# EAGLE design TuringGatesBuffer (EAGLE 9.6.2)
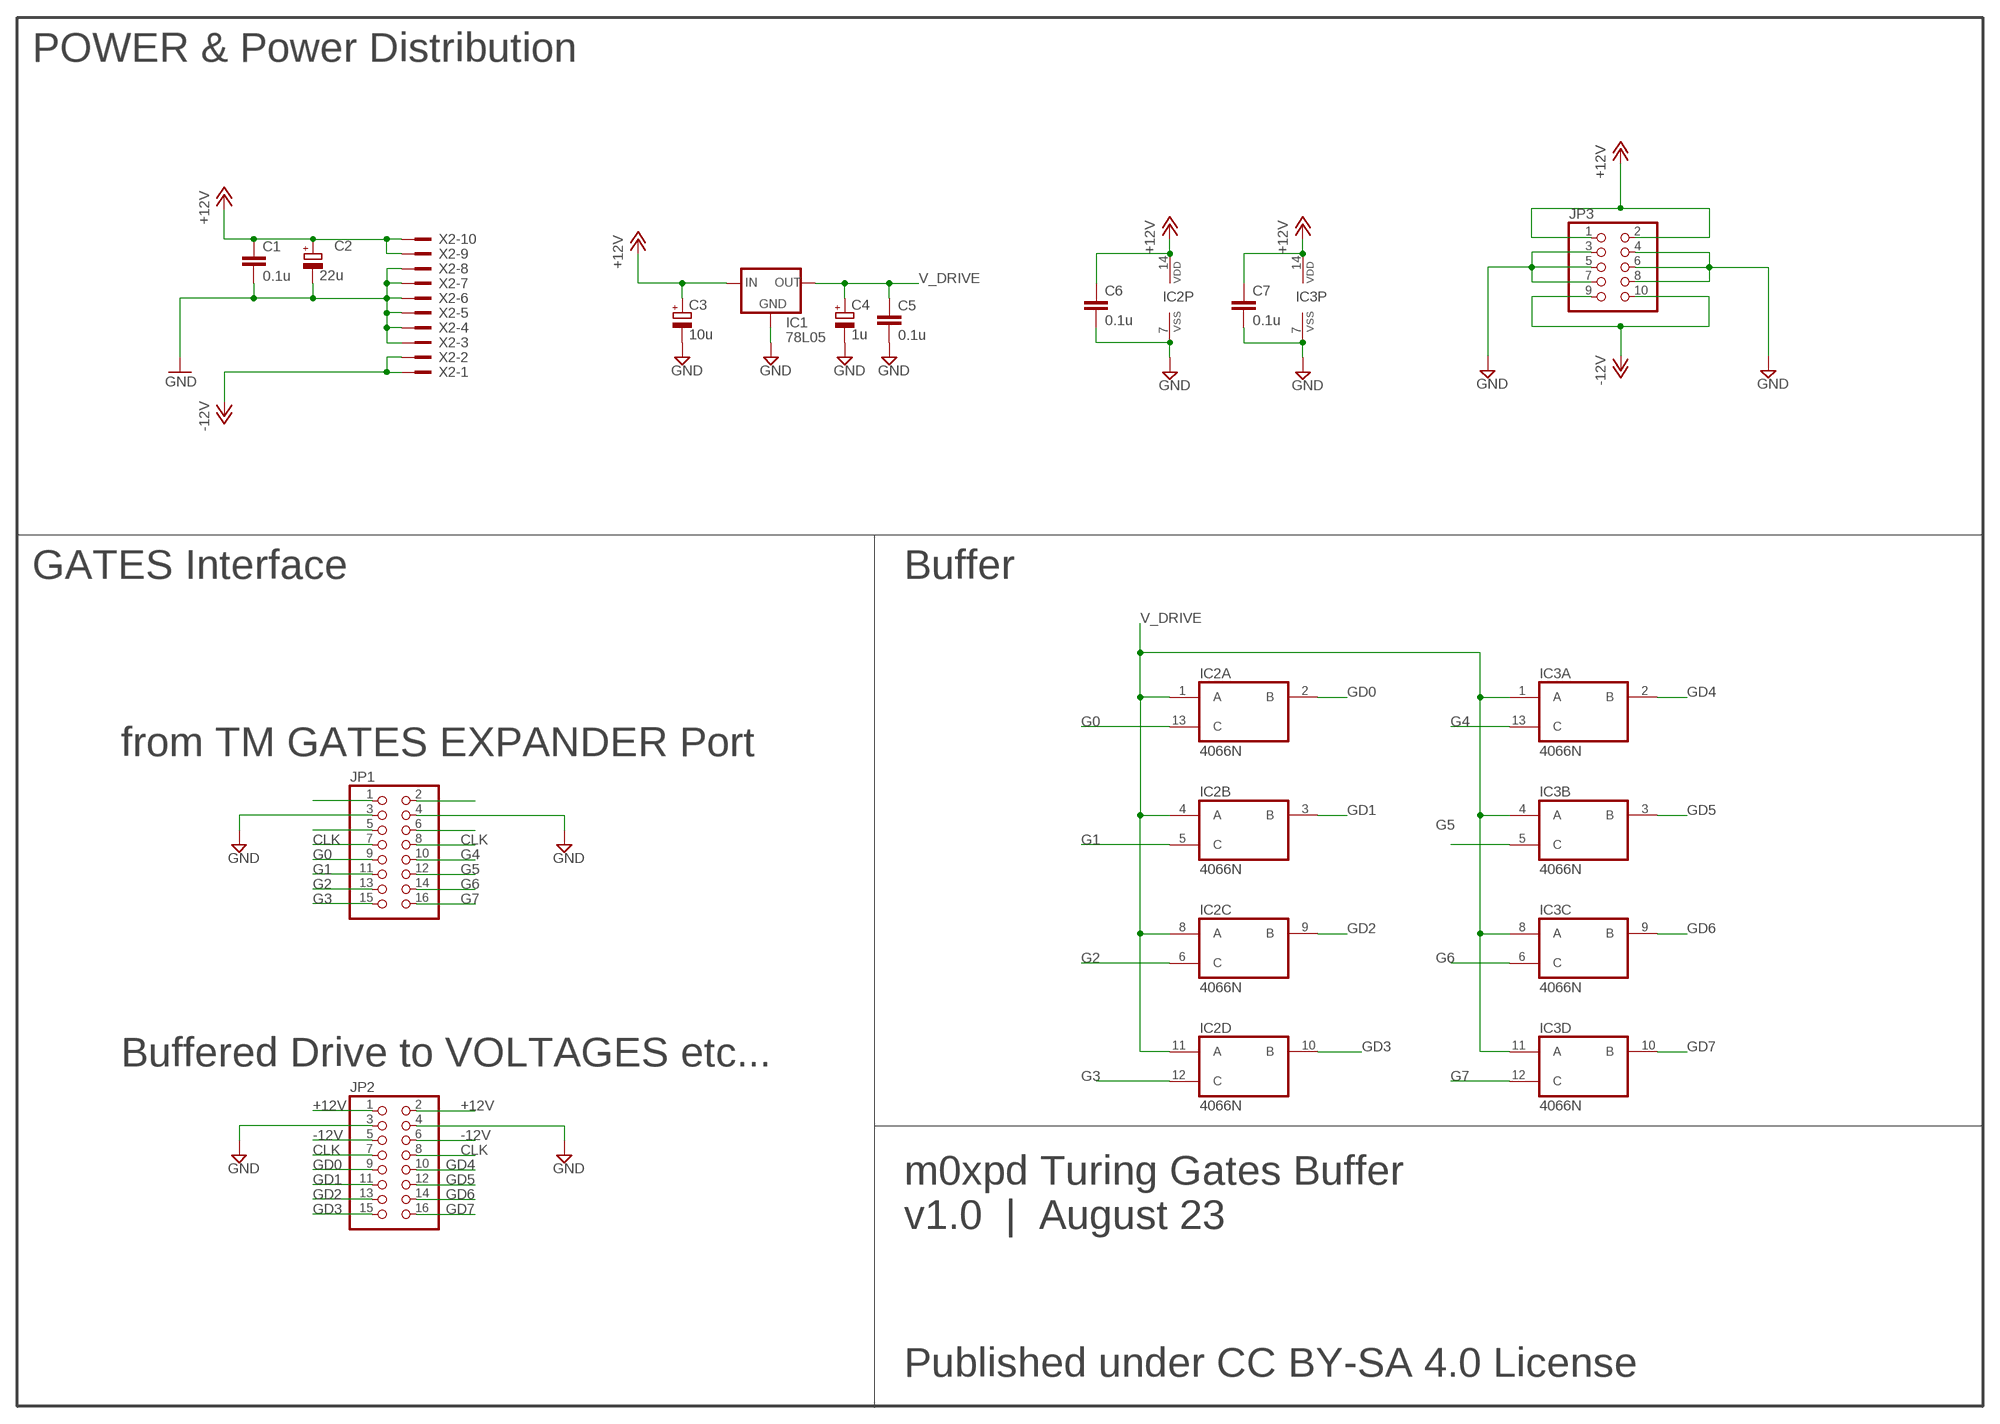
[diagram p0: schematic, sheet 1]

## Parts
C1  0.1u  C-EU050-025X075  [C050-025X075]
C2  22u  CPOL-EUE2.5-5  [E2,5-5]
C3  10u  CPOL-EUE2.5-5  [E2,5-5]
C4  1u  CPOL-EUE2.5-5  [E2,5-5]
C5  0.1u  C-EU050-025X075  [C050-025X075]
C6  0.1u  C-EU050-025X075  [C050-025X075]
C7  0.1u  C-EU050-025X075  [C050-025X075]
IC1  78L05  78LXX  [78LXX]
IC2  4066N  [DIL14]
IC3  4066N  [DIL14]
JP1  PINHD-2X8  [2X08]
JP2  PINHD-2X8  [2X08]
JP3  PINHD-2X5  [2X05]
X2  2510-  [PAK100/2500-10]

## Nets
+12V: C1.1 C2.+ C3.+ C6.1 C7.1 IC1.IN IC2.14(P:VDD) IC3.14(P:VDD) JP2.1 JP2.2 JP3.1 JP3.2 X2.9 X2.10
-12V: JP2.5 JP2.6 JP3.9 JP3.10 X2.1 X2.2
CLK: JP1.7 JP1.8 JP2.7 JP2.8
G0: IC2.13(A:C) JP1.9
G1: IC2.5(B:C) JP1.11
G2: IC2.6(C:C) JP1.13
G3: IC2.12(D:C) JP1.15
G4: IC3.13(A:C) JP1.10
G5: IC3.5(B:C) JP1.12
G6: IC3.6(C:C) JP1.14
G7: IC3.12(D:C) JP1.16
GD0: IC2.2(A:B) JP2.9
GD1: IC2.3(B:B) JP2.11
GD2: IC2.9(C:B) JP2.13
GD3: IC2.10(D:B) JP2.15
GD4: IC3.2(A:B) JP2.10
GD5: IC3.3(B:B) JP2.12
GD6: IC3.9(C:B) JP2.14
GD7: IC3.10(D:B) JP2.16
GND: C1.2 C2.- C3.- C4.- C5.2 C6.2 C7.2 IC1.GND IC2.7(P:VSS) IC3.7(P:VSS) JP1.3 JP1.4 JP2.3 JP2.4 JP3.3 JP3.4 JP3.5 JP3.6 JP3.7 JP3.8 X2.3 X2.4 X2.5 X2.6 X2.7 X2.8
N$1: JP1.1
N$2: JP1.2
N$5: JP1.6
N$6: JP1.5
V_DRIVE: C4.+ C5.1 IC1.OUT IC2.1(A:A) IC2.4(B:A) IC2.8(C:A) IC2.11(D:A) IC3.1(A:A) IC3.4(B:A) IC3.8(C:A) IC3.11(D:A)

## Notes on the sheet
- POWER & Power Distribution
- GATES Interface | Buffer
- from TM GATES EXPANDER Port
- Buffered Drive to VOLTAGES etc...
- m0xpd Turing Gates Buffer
- v1.0  |  August 23
- Published under CC BY-SA 4.0 License

## Library data of the parts
C1 C5-C7 = rcl:C-EU: CAPACITOR, European symbol; SPICEPREFIX: C
C2-C4 = rcl:CPOL-EU: POLARIZED CAPACITOR, European symbol; SPICEPREFIX: C
IC1 = v-reg:78LXX: VOLTAGE REGULATOR
IC2 IC3 = 40xx:4066: Quad bilateral ANALOG SWITCH
JP1 JP2 = pinhead:PINHD-2X8: PIN HEADER
JP3 = pinhead:PINHD-2X5: PIN HEADER
X2 = con-3m:2510-: 3M (TM) Pak 100 4-Wall Header Source: 3M; MF: 3M; MPN: 2510-6002UB; OC_FARNELL: 9838244; OC_NEWARK: 46F4725

## Board
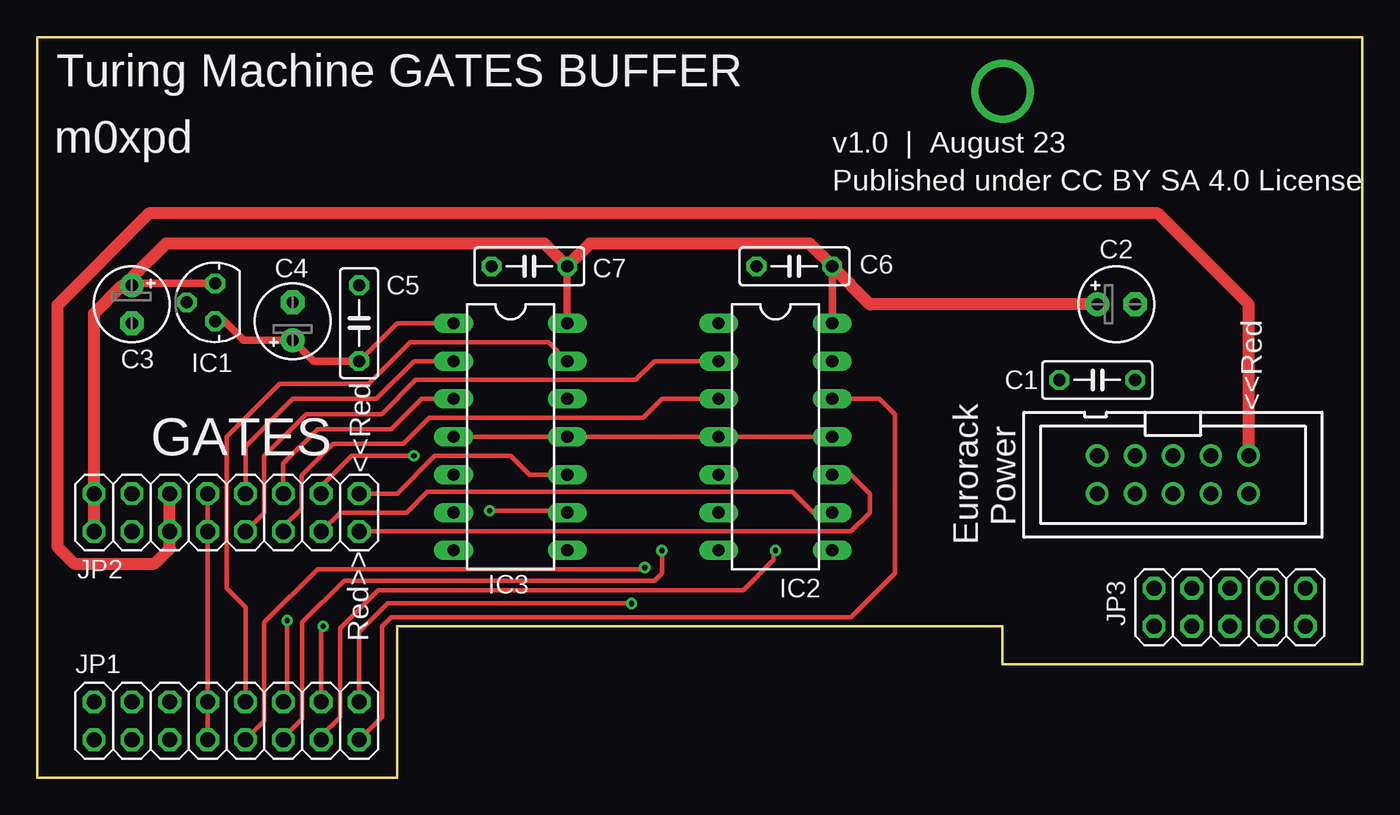
[diagram p1: board, top side]
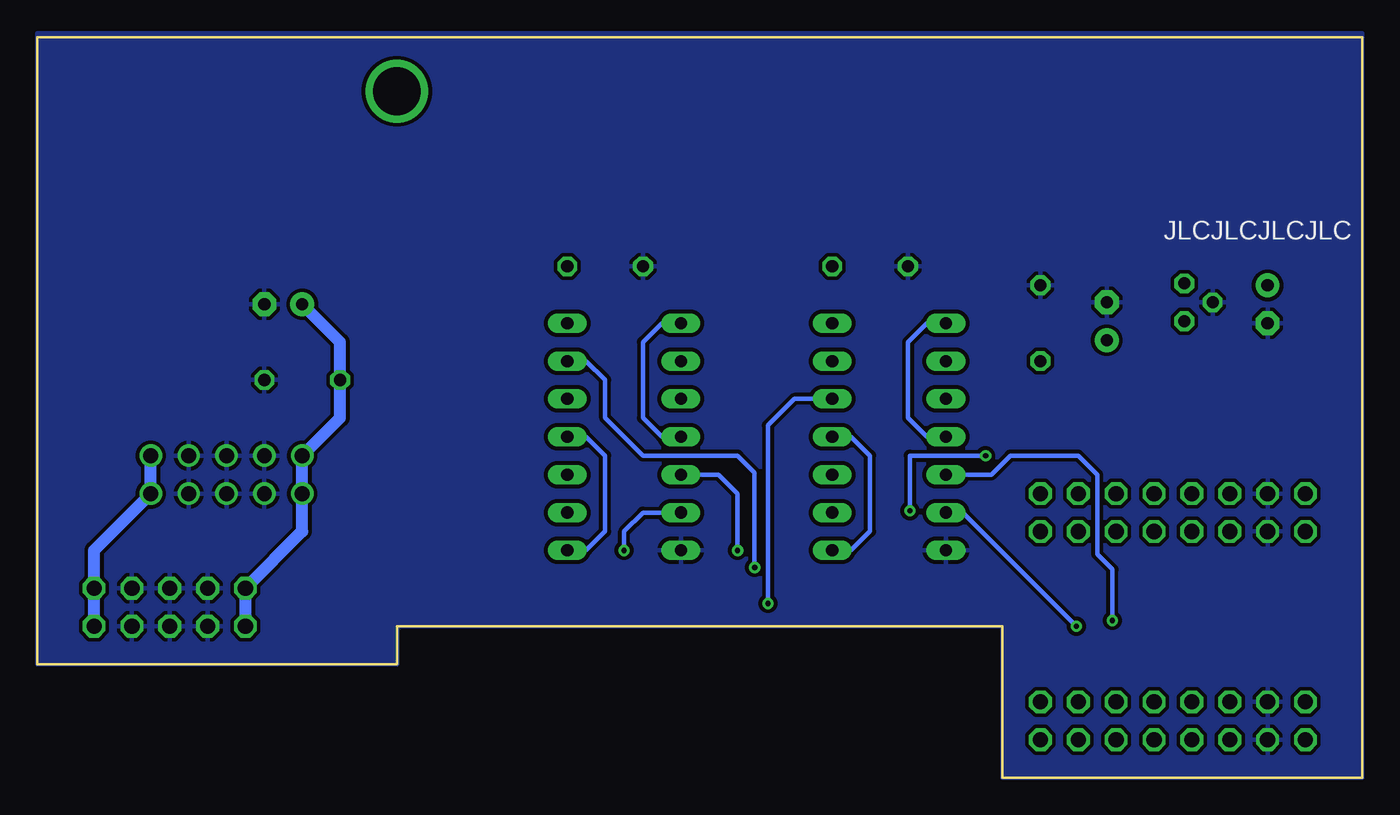
[diagram p2: board, bottom side, seen from below]

Size 88.9 x 49.66 mm. Coordinates in mm from the lower left corner, seen from the top.
Outline: 0,49.66 88.9,49.66 88.9,7.62 64.77,7.62 64.77,10.16 24.13,10.16 24.13,0 0,0 0,49.66
Copper layers (1*16): Top 0.035mm / dielectric 1.5mm / Bottom 0.035mm
Design rules "default *": minimum track width 6mil, minimum drill 0.35mm, track to track 10mil, track to pad 10mil, pad to pad 6mil, via to via 6mil, smd to smd 6mil, copper to edge 0mil, drill to drill 6mil, minimum pad ring 10mil, minimum via ring 8mil, stop-mask expansion 4mil, vias tented up to drill 0mil, thermal gap 10mil

### Footprints (pad centres in the part's own frame; a part is rotated, then mirrored left to right if it is on the bottom)
C050-025X075 = drill 0.813 octagon: 1 -2.54,0; 2 2.54,0
E2,5-5 = drill 0.813 pad 1.6: + -1.27,0 | drill 0.813 pad 1.6 octagon: - 1.27,0
78LXX = drill 0.813 octagon: GND 0,1.905; IN 1.27,0; OUT -1.27,0
DIL14 = drill 0.813 long: 1 -7.62,-3.81; 2 -5.08,-3.81; 3 -2.54,-3.81; 4 0,-3.81; 5 2.54,-3.81; 6 5.08,-3.81; 7 7.62,-3.81; 8 7.62,3.81; 9 5.08,3.81; 10 2.54,3.81; 11 0,3.81; 12 -2.54,3.81; 13 -5.08,3.81; 14 -7.62,3.81
2X08 = drill 1.016 octagon: 1 -8.89,-1.27; 2 -8.89,1.27; 3 -6.35,-1.27; 4 -6.35,1.27; 5 -3.81,-1.27; 6 -3.81,1.27; 7 -1.27,-1.27; 8 -1.27,1.27; 9 1.27,-1.27; 10 1.27,1.27; 11 3.81,-1.27; 12 3.81,1.27; 13 6.35,-1.27; 14 6.35,1.27; 15 8.89,-1.27; 16 8.89,1.27
2X05 = drill 1.016 octagon: 1 -5.08,-1.27; 2 -5.08,1.27; 3 -2.54,-1.27; 4 -2.54,1.27; 5 0,-1.27; 6 0,1.27; 7 2.54,-1.27; 8 2.54,1.27; 9 5.08,-1.27; 10 5.08,1.27
PAK100/2500-10 = drill 1 pad 1.422: 1 -5.08,-1.27; 2 -5.08,1.27; 3 -2.54,-1.27; 4 -2.54,1.27; 5 0,-1.27; 6 0,1.27; 7 2.54,-1.27; 8 2.54,1.27; 9 5.08,-1.27; 10 5.08,1.27

### Placement (x,y rotation side)
C1  71.12,26.67 0 top
C2  72.39,31.75 0 top
C3  6.35,31.75 270 top
C4  17.14,30.61 90 top
C5  21.59,30.48 90 top
C6  50.8,34.29 180 top
C7  33.02,34.29 180 top
IC1  11.94,31.88 90 top
IC2  49.53,22.86 270 top
IC3  31.75,22.86 270 top
JP1  12.7,3.81 0 top
JP2  12.7,17.78 0 top
JP3  80.01,11.43 0 top
X2  76.2,20.32 180 top

### Tracks (layer width: path | path; a pad name or v marks a point on that pad's centre or on a via)
+12V
  Top 0.508: IC1.IN 6.48,33.15 C3.+ | IC3.14 C7.1 | IC2.14 C6.1
  Top 0.813: C2.+ 55.88,31.75 C6.1 51.82,35.81 37.08,35.81 C7.1 34.04,35.81 8.64,35.81 6.35,33.53 C3.+ 5.71,33.02 3.81,31.11 JP2.2 JP2.1
  Bottom 0.813: JP3.1 JP3.2 71.12,16.51 X2.10 X2.9 68.58,24.13 C1.1 68.58,29.21 C2.+
-12V
  Top 0.813: X2.1 81.28,31.75 75.18,37.85 7.49,37.85 1.35,31.7 1.35,15.49 2.49,14.35 7.87,14.35 8.89,15.37 JP2.5 JP2.6
  Bottom 0.813: JP3.9 JP3.10 85.09,15.24 X2.2 X2.1
CLK
  Top 0.305: JP1.7 JP1.8 JP2.7 JP2.8
G0  (via drill 0.35 pad 0.6)
  Top 0.305: JP1.9 15.24,3.81 15.24,10.41 18.8,13.97 40.64,13.97 v40.77,14.1
  Bottom 0.305: v40.77,14.1 40.77,20.45 41.91,21.59 48.26,21.59 50.8,24.13 50.8,26.67 52.07,27.94 IC2.13
G1  (via drill 0.35 pad 0.6)
  Top 0.305: JP1.11 16.51,2.67 17.78,3.94 17.78,10.41 20.57,13.21 41.4,13.21 41.91,13.72 v41.91,15.24
  Bottom 0.305: v41.91,15.24 41.91,19.05 43.18,20.32 IC2.5
G2  (via drill 0.35 pad 0.6)
  Top 0.305: JP1.13 19.05,2.79 20.32,4.06 20.32,10.03 22.86,12.57 47.37,12.57 49.4,14.61 49.4,15.11 v49.53,15.24
  Bottom 0.305: v49.53,15.24 49.53,16.51 48.26,17.78 IC2.6
G3
  Top 0.305: JP1.15 23.11,4.06 23.14,4.06 23.14,10.17 23.74,10.77 54.59,10.77 57.53,13.72 57.53,24.38 56.52,25.4 IC2.12
G4
  Top 0.305: IC3.13 34.29,29.21 25.02,29.21 22.23,26.42 16.26,26.42 12.7,22.86 12.7,12.7 13.97,11.43 JP1.10
G5  (via drill 0.35 pad 0.6)
  Top 0.305: v16.76,10.54 16.76,5.33 JP1.12
  Bottom 0.305: IC3.5 24.89,20.32 23.62,21.59 19.05,21.59 17.78,20.32 17.78,14.99 16.76,13.97 v16.76,10.54
G6  (via drill 0.35 pad 0.6)
  Top 0.305: JP1.14 19.05,10.03 v19.18,10.16
  Bottom 0.305: v19.18,10.16 26.8,17.78 IC3.6
G7  (via drill 0.35 pad 0.6)
  Top 0.305: v39.88,11.68 23.5,11.68 21.59,9.78 JP1.16
  Bottom 0.305: IC3.12 38.1,25.4 39.88,23.62 v39.88,11.68
GD0
  Top 0.305: JP2.9 15.24,17.78 15.24,21.59 18.03,24.38 23.11,24.38 25.4,26.67 40.13,26.67 41.4,27.94 IC2.2
GD1
  Top 0.305: JP2.11 16.51,16.82 17.73,18.03 17.73,20.27 19.86,22.4 24.56,22.4 26.29,24.13 40.64,24.13 41.91,25.4 IC2.3
GD2
  Top 0.305: JP2.13 20.32,17.78 24.77,17.78 26.16,19.18 50.67,19.18 52.07,17.78 IC2.9
GD3
  Top 0.305: JP2.15 54.61,16.51 55.88,17.78 55.88,19.05 54.61,20.32 IC2.10
GD4
  Top 0.305: JP2.10 13.97,22.23 17.14,25.4 22.73,25.4 25.27,27.94 IC3.2
GD5
  Top 0.305: JP2.12 16.51,21.08 18.8,23.37 23.75,23.37 25.78,25.4 IC3.3
GD6  (via drill 0.35 pad 0.6)
  Top 0.305: v25.27,21.59 21.08,21.59 19.05,19.56 JP2.14 | v30.35,17.91 35.43,17.91 IC3.9
  Bottom 0.305: v30.35,17.91 30.35,21.59 v25.27,21.59
GD7
  Top 0.305: IC3.10 33.02,20.32 31.75,21.59 26.67,21.59 24.13,19.05 JP2.16
GND
  pour Bottom: 0,49.91 88.9,49.91 88.9,7.62 64.77,7.62 64.77,10.16 24.13,10.16 24.13,0 0,0
N$3  (via drill 3.2 pad 3.2)
  other vias: 64.77,46.04
V_DRIVE
  Top 0.305: C5.1 24.13,30.48 IC3.1 | IC3.4 IC3.11 IC2.4 IC2.11
  Top 0.508: IC1.OUT 12.57,30.61 13.84,29.34 C4.+ 18.54,27.94 C5.1
  Bottom 0.305: IC3.1 29.21,30.48 30.48,29.21 30.48,24.13 29.21,22.86 IC3.4 | IC3.8 34.29,15.24 33.02,16.51 33.02,21.59 34.29,22.86 IC3.11 | IC2.8 52.07,15.24 50.8,16.51 50.8,21.59 52.07,22.86 IC2.11 | IC2.1 46.99,30.48 48.26,29.21 48.26,24.13 46.99,22.86 IC2.4

### Text on the board
tNames: Turing Machine GATES BUFFER | m0xpd | v1.0 | August 23 | Published under CC BY SA 4.0 License | <<Red | GATES | <<Red | Eurorack / Power | Red>>
bNames: JLCJLCJLCJLC